# Altium schematic sheet sch.SchDoc: DataLogger Design
size 420 x 297 mm; Title2: hello; ENG_APP_DATE: --/--/--; DSN_APP_DATE: --/--/--; CHK_APP_DATE: --/--/--; Author: Minh-An DAO; DrawnBy: Minh-An DAO; Revision: 1.0; ItemRevision: 1.0; SCH_SCALE: 1:1
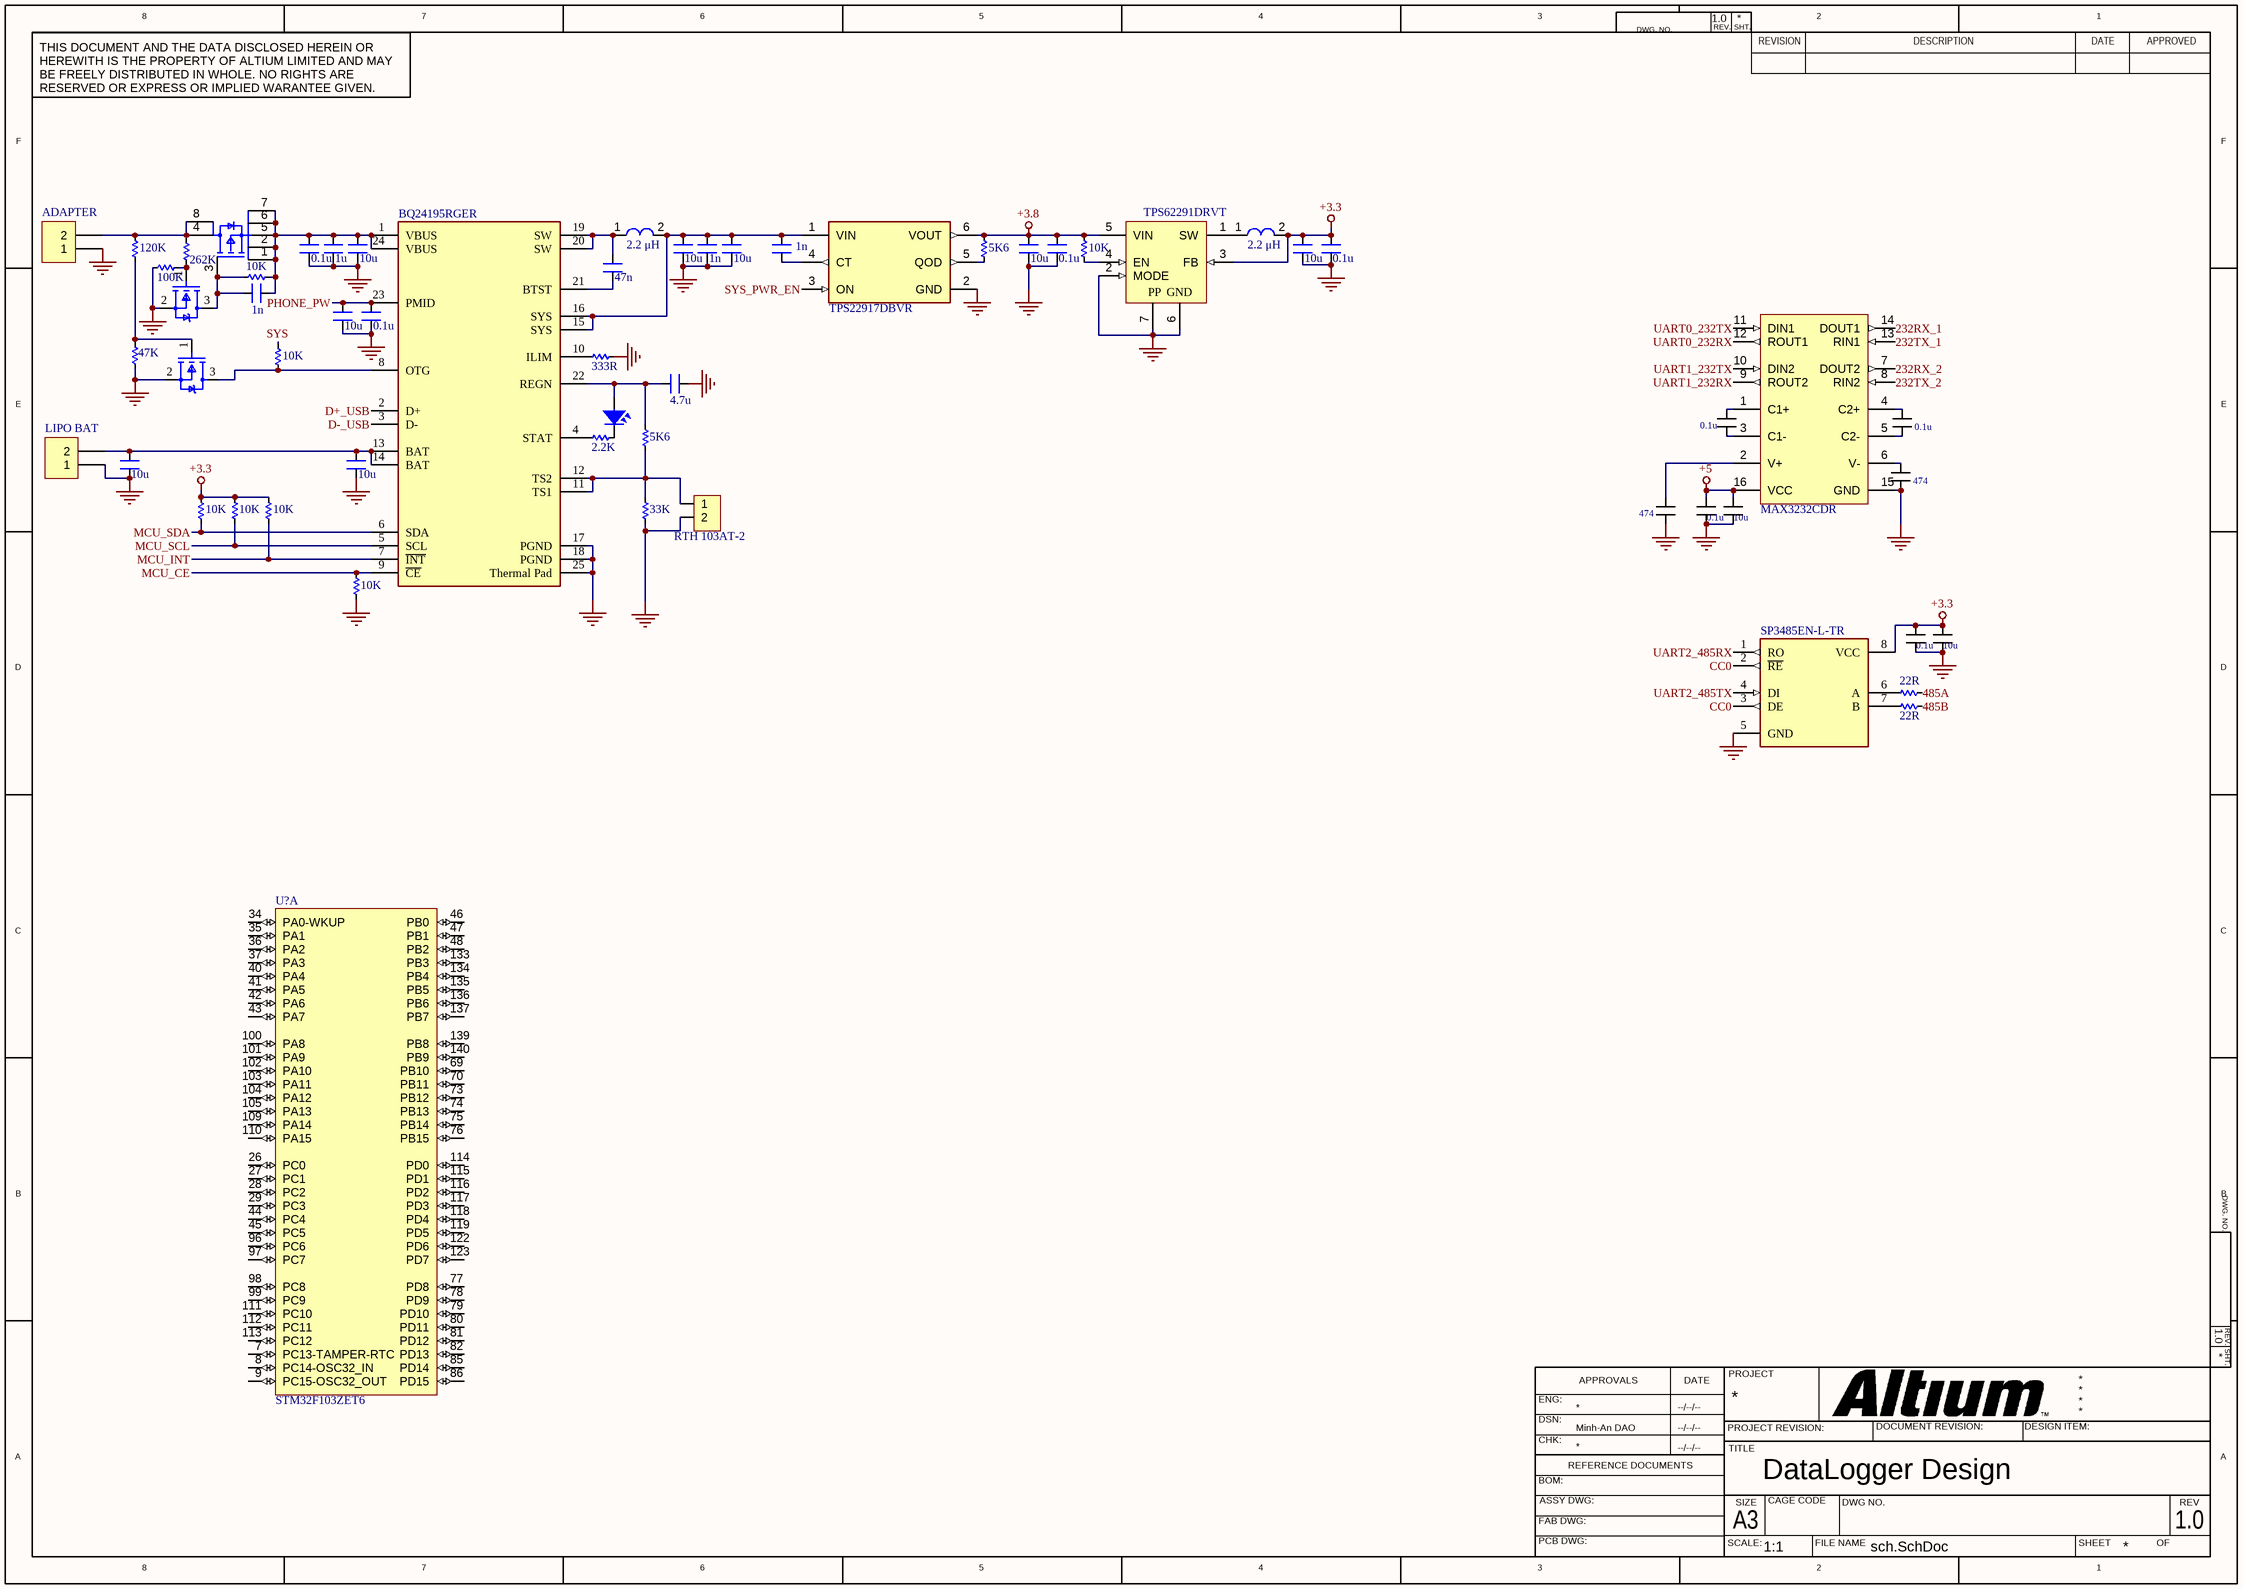
[diagram p0: sch.SchDoc]

## Parts
(Parts that share a designator on the sheet are numbered #1, #2 ... from top to bottom, then left to right.)
*  CSD25310Q2  [CSD25310Q2_DQK_0]  (value not drawn)
C?#1  0.1u  [CN-SMD-0805]
C?#2  0.1u  [CN-SMD-0805]
C?#3  474  [CN-SMD-0805]
C?#4  474  [CN-SMD-0805]
C?#5  0.1u  [CN-SMD-0805]
C?#6  10u  [CN-SMD-0805]
C?#7  RTH 103AT-2  [Header2]
C?#8  0.1u  [CN-SMD-0805]
C?#9  10u  [CN-SMD-0805]
Cx?#1  0.1u  [CN-SMD-0805]
Cx?#2  1u  [CN-SMD-0805]
Cx?#3  10u  [CN-SMD-0805]
Cx?#4  10u  [CN-SMD-0805]
Cx?#5  1n  [CN-SMD-0805]
Cx?#6  10u  [CN-SMD-0805]
Cx?#7  1n  [CN-SMD-0805]
Cx?#8  10u  [CN-SMD-0805]
Cx?#9  0.1u  [CN-SMD-0805]
Cx?#10  10u  [CN-SMD-0805]
Cx?#11  0.1u  [CN-SMD-0805]
Cx?#12  47n  [CN-SMD-0805]
Cx?#13  1n  [CN-SMD-0805]
Cx?#14  10u  [CN-SMD-0805]
Cx?#15  0.1u  [CN-SMD-0805]
Cx?#16  4.7u  [CN-SMD-0805]
Cx?#17  10u  [CN-SMD-0805]
Cx?#18  10u  [CN-SMD-0805]
J?#1  ADAPTER  [KF2-3.5]
J?#2  LIPO BAT  [KF2-3.5]
L?#1  2.2 μH  [L-SMD-M-7.3x4.5]
L?#2  2.2 μH  [L-SMD-M-7.3x4.5]
LED?  GREEN  [LED-0805-Green]  (value not drawn)
Q*  SI2312BDS-T1-E3  [SI2312BDS-T1-E3_0]  (value not drawn)
Q*?  SI2312BDS-T1-E3  [SI2312BDS-T1-E3_0]  (value not drawn)
R?#1  120K  [RES-SMD-0805]
R?#2  5K6  [RES-SMD-0805]
R?#3  10K  [RES-SMD-0805]
R?#4  262K  [RES-SMD-0805]
R?#5  100K  [RES-SMD-0805]
R?#6  10K  [RES-SMD-0805]
R?#7  47K  [RES-SMD-0805]
R?#8  10K  [RES-SMD-0805]
R?#9  333R  [RES-SMD-0805]
R?#10  2.2K  [RES-SMD-0805]
R?#11  5K6  [RES-SMD-0805]
R?#12  10K  [RES-SMD-0805]
R?#13  10K  [RES-SMD-0805]
R?#14  10K  [RES-SMD-0805]
R?#15  33K  [RES-SMD-0805]
R?#16  10K  [RES-SMD-0805]
R?#17  22R  [RES-SMD-0805]
R?#18  22R  [RES-SMD-0805]
U?#1  BQ24195RGER  [BQ24195_RGE0024H_0]
U?#2  TPS62291DRVT  [DRV0006A_V]
U?#3  TPS22917DBVR  [FP-DBV0006A-IPC_A]
U?#4  MAX3232CDR  [D0016A_L]
U?#5  SP3485EN-L-TR  [MaxLinear_NSOIC8_IPC_C]
U?#6  STM32F103ZET6  [STM-LQFP144_V]  (part A of 3)

## Nets
+3.3: C?#8.1 C?#9.1 Cx?#10.2 Cx?#11.2 L?#2.2 R?#12.1 R?#13.1 R?#14.1 U?#2.3(FB) U?#5.8(VCC)
+3.8: Cx?#8.2 Cx?#9.2 R?#2.1 R?#3.1 U?#2.5(VIN) U?#3.6(VOUT)
+5: C?#5.1 C?#6.1 U?#4.16(VCC)
GND: C?#3.2 C?#4.2 C?#5.2 C?#6.2 C?#7.2 C?#8.2 C?#9.2 Cx?#1.1 Cx?#2.1 Cx?#3.1 Cx?#4.1 Cx?#5.1 Cx?#6.1 Cx?#8.1 Cx?#9.1 Cx?#10.1 Cx?#11.1 Cx?#14.1 Cx?#15.1 Cx?#16.1 Cx?#17.1 Cx?#18.1 J?#1.1 J?#2.1 Q*.2(S) Q*?.2(S) R?#5.1 R?#7.1 R?#9.2 R?#15.2 R?#16.2 U?#1.17(PGND) U?#1.18(PGND) U?#1.25(Thermal_Pad) U?#2.2(MODE) U?#2.6(GND) U?#2.7(EP) U?#3.2(GND) U?#4.15(GND) U?#5.5(GND)
232RX_1: U?#4.14(DOUT1)
232RX_2: U?#4.7(DOUT2)
232TX_1: U?#4.13(RIN1)
232TX_2: U?#4.8(RIN2)
485A: R?#17.2
485B: R?#18.2
CC0: U?#5.2(~{RE}) U?#5.3(DE)
D+_USB: U?#1.2(D+)
D-_USB: U?#1.3(D-)
MCU_CE: R?#16.1 U?#1.9(~{CE})
MCU_INT: R?#14.2 U?#1.7(~{INT})
MCU_SCL: R?#13.2 U?#1.5(SCL)
MCU_SDA: R?#12.2 U?#1.6(SDA)
PHONE_PW: Cx?#14.2 Cx?#15.2 U?#1.23(PMID)
SYS: R?#8.1
SYS_PWR_EN: U?#3.3(ON)
UART0_232RX: U?#4.12(ROUT1)
UART0_232TX: U?#4.11(DIN1)
UART1_232RX: U?#4.9(ROUT2)
UART1_232TX: U?#4.10(DIN2)
UART2_485RX: U?#5.1(RO)
UART2_485TX: U?#5.4(DI)
Net*_1: *.1(S) *.2(S) *.5(S) *.6(S) *.7(S_PAD) Cx?#1.2 Cx?#2.2 Cx?#3.2 Cx?#13.1 R?#6.1 U?#1.1(VBUS) U?#1.24(VBUS)
Net*_3: *.3(G) Cx?#13.2 Q*.3(D) R?#6.2
Net*_4: *.4(D) *.8(D_PAD) J?#1.2 R?#1.1 R?#4.1
NetC?#1_1: C?#1.1 U?#4.1(C1+)
NetC?#1_2: C?#1.2 U?#4.3(C1-)
NetC?#2_1: C?#2.1 U?#4.4(C2+)
NetC?#2_2: C?#2.2 U?#4.5(C2-)
NetC?#3_1: C?#3.1 U?#4.6(V-)
NetC?#4_1: C?#4.1 U?#4.2(V+)
NetC?#7_1: C?#7.1 R?#11.2 R?#15.1 U?#1.11(TS1) U?#1.12(TS2)
NetCx?#4_2: Cx?#4.2 Cx?#5.2 Cx?#6.2 Cx?#7.2 L?#1.2 U?#1.15(SYS) U?#1.16(SYS) U?#3.1(VIN)
NetCx?#7_1: Cx?#7.1 U?#3.4(CT)
NetCx?#12_1: Cx?#12.1 U?#1.21(BTST)
NetCx?#12_2: Cx?#12.2 L?#1.1 U?#1.19(SW) U?#1.20(SW)
NetCx?#16_2: Cx?#16.2 LED?.1 R?#11.1 U?#1.22(REGN)
NetCx?#17_2: Cx?#17.2 Cx?#18.2 J?#2.2 U?#1.13(BAT) U?#1.14(BAT)
NetL?#2_1: L?#2.1 U?#2.1(SW)
NetLED?_2: LED?.2 R?#10.2
NetQ*?_1: Q*?.1(G) R?#1.2 R?#7.2
NetQ*?_3: Q*?.3(D) R?#8.2 U?#1.8(OTG)
NetQ*_1: Q*.1(G) R?#4.2 R?#5.2
NetR?#2_2: R?#2.2 U?#3.5(QOD)
NetR?#3_2: R?#3.2 U?#2.4(EN)
NetR?#9_1: R?#9.1 U?#1.10(ILIM)
NetR?#10_1: R?#10.1 U?#1.4(STAT)
NetR?#17_1: R?#17.1 U?#5.6(A)
NetR?#18_1: R?#18.1 U?#5.7(B)

Not connected (* = marked no-connect by the designer): U?#6 7(PC13-TAMPER-RTC) 8(PC14-OSC32_IN) 9(PC15-OSC32_OUT) 26(PC0) 27(PC1) 28(PC2) 29(PC3) 34(PA0-WKUP) 35(PA1) 36(PA2) 37(PA3) 40(PA4) 41(PA5) 42(PA6) 43(PA7) 44(PC4) 45(PC5) 46(PB0) 47(PB1) 48(PB2) 69(PB10) 70(PB11) 73(PB12) 74(PB13) 75(PB14) 76(PB15) 77(PD8) 78(PD9) 79(PD10) 80(PD11) 81(PD12) 82(PD13) 85(PD14) 86(PD15) 96(PC6) 97(PC7) 98(PC8) 99(PC9) 100(PA8) 101(PA9) 102(PA10) 103(PA11) 104(PA12) 105(PA13) 109(PA14) 110(PA15) 111(PC10) 112(PC11) 113(PC12) 114(PD0) 115(PD1) 116(PD2) 117(PD3) 118(PD4) 119(PD5) 122(PD6) 123(PD7) 133(PB3) 134(PB4) 135(PB5) 136(PB6) 137(PB7) 139(PB8) 140(PB9)

## Notes on the sheet
- 8
- 7
- 6
- 5
- 4
- 3
- DWG. NO.
- REV.
- SHT.
- REVISION
- 2
- DESCRIPTION
- DATE
- 1
- APPROVED
- THIS DOCUMENT AND THE DATA DISCLOSED HEREIN OR HEREWITH IS THE PROPERTY OF ALTIUM LIMITED AND MAY BE FREELY DISTRIBUTED IN WHOLE. NO RIGHTS ARE RESERVED OR EXPRESS OR IMPLIED WARANTEE GIVEN.
- F
- E
- D
- C
- B
- ENG:
- APPROVALS
- PROJECT
- A
- DSN:
- CHK:
- REFERENCE DOCUMENTS
- PROJECT REVISION:
- TITLE
- DOCUMENT REVISION:
- DESIGN ITEM:
- BOM:
- FAB DWG:
- PCB DWG:
- ASSY DWG:
- SCALE:
- A3
- SIZE
- CAGE CODE
- FILE NAME
- DWG NO.
- SHEET
- OF
- REV
- (in symbol CMP-0323-00380-3) PP

## Library data of the parts
* = CSD25310Q2: CSD25310Q2 20 V P-Channel NexFET™ Power MOSFETs /
C?#1-C?#6 C?#8 C?#9 = CAP
C?#7 = Header2: Header IDC, 2 x 1 Pin Vertical 2.54mm Pitch (Non-Boxed, Male); Manufacturer: W¨¹rth Elektronik eiSos GmbH; partNo: 613002143121; ComponentLink1 Description: Manufacturer; ComponentLink2 Description: Datasheet; NoPins: 02; Created Date: 29 March 2013; ComponentLink1URL: http://www.we-online.com; ComponentLink2URL: http://katalog.we-online.de/em/datasheet/6130xx143121.pdf; Created by: Karrer Zheng
Cx?#1-Cx?#18 = CN: Value: 33pF
J?#1 J?#2 = KF2: 3.9-17V; Manufacturer: Würth Elektronik eiSos GmbH; partNo: 691103110002; ComponentLink1 Description: Manufacturer; ComponentLink2 Description: Datasheet; NoPins: 2; Created Date: 29 October 2013; ComponentLink1URL: http://www.we-online.com; ComponentLink2URL: http://katalog.we-online.de/em/datasheet/6911031100xx.pdf; Created by: Karrer Zheng
L?#1 L?#2 = L-SMD-1: partNo: 78477010; Manufacturer: Wurth Elektronik; Inductance: 2.2 μH; ComponentLink1Description: Manufacturer; ComponentLink1URL: http://www.we-online.de; Created by: Baojun Chen; Created Date: Nov.2015; ComponentLink2Description: Datasheet; ComponentLink2URL: http://katalog.we-online.de/pbs/datasheet/78477010.pdf
LED? = LED SMD: Value: LED 3 - 5 ly 2 Colour
Q* Q*? = SI2312BDS-T1-E3: N-Channel 20 V (D-S) MOSFET
R?#1-R?#18 = Res-SMD: Resistor; Manufacturer: Generic Components; Class: Passive; Published: 08/06/2000; Publisher: Altium Hobart Technology Centre
U?#1 = BQ24195RGER: bq24195 I2C Controlled 2.5-A /4.5-A Single Cell USB/Adapter Charger with 5.1 V at 1 A /5.1 V at 2.1 A Synchronous Boost Operation
U?#2 = CMP-0323-00380-3: Buck Step Down Regulator with 2.3 to 6 V Input and 3.3 V Output, -40 to 85 degC, 6-Pin SON (DRV), Green (RoHS & no Sb/Br); Manufacturer: Texas Instruments; Preset Vout(V): 3.3; Switch Current Limit(Typ)(A): 1.4; Synchronous Rectification: TRUE; Duty Cycle(Max)(%): 100; Iout(Max)(A): 1; Vin(Max)(V): 6; Iq(Typ)(mA): 0.015; Rating: Catalog; SubFamily: Step-Down Regulator; Vin(Min)(V): 2.3; PartNumber: TPS62291DRVT; Mounting Technology: Surface Mount; ComponentLink2Description: Package Specification; Topology: Buck; ComponentLink1Description: Datasheet; Eco-Plan: Green (RoHS & no Sb/Br); Regulated Outputs(#): 1; ComponentLink1URL: http://www.ti.com/general/docs/lit/getliterature.tsp?genericPartNumber=TPS62291&fileType=pdf; DatasheetVersion: SLVS764C; ComponentLink3Description: URL Link1; Vout(Min)(V): 3.3; Vout(Max)(V): 3.3; PackageDescription: 6-Pin Plastic Small Outline No-Lead, 2 x 2 x 0.8 mm Body, 0.65 mm Pitch, Exposed Pad; ComponentLink2URL: http://www.ti.com/litv/pdf/mpds216d; PackageReference: DRV0006A; ComponentLink3URL: Samples URL:http://www.ti.com/product/tps62291#samples; PackageVersion: revE, Oct-2010
U?#3 = CMP-04912-000029-1: IC PWR SWITCH P-CHAN 1:1 SOT23-6; Number of Outputs: 1; Output Configuration: High Side; Fault Protection: Reverse Current; Interface: On/Off; Max Output Current: 2A; Max Operating Temperature: 125°C; Case/Package: SOT-23-6; Packaging: Tape and Reel; Number of Channels: 1; Min Operating Temperature: -40°C
U?#4 = CMP-0299-00399-2: 3-V to 5.5-V Multichannel RS-232 Line Driver / Receiver with ±15-kV ESD Protection, 0 to 70 degC, 16-Pin SOIC (D), Green (RoHS & no Sb/Br); Receivers Per Package: 2; ESD HBM(kV): +/-15; ICC(Max)(mA): 1; Supply Voltage(s)(V): 3.3 or 5.0; Single Supply: TRUE; ComponentLink1URL: www.ti.com; ComponentLink3URL: http://www.ti.com/litv/pdf/mpds178g; PackageReference: D0016A; ComponentLink2Description: Datasheet; ComponentLink2URL: http://www.ti.com/general/docs/lit/getliterature.tsp?genericPartNumber=MAX3232&fileType=pdf; ComponentLink1Description: Manufacturer URL; PackageDescription: 16-Pin Plastic Small Outline Integrated Circuit, 9.9 x 3.9 mm, Pitch 1.27 mm Pitch; PackageVersion: revM, Jun-2011; Drivers Per Package: 2; SubFamily: RS-232; DatasheetVersion: SLLS410I; ComponentLink3Description: Package Specification; RS-232: TRUE
U?#6 = CMP-0237-00176-3: ARM Cortex-M3 32-bit MCU, 512 KB Flash, 64 KB Internal RAM, 112 I/Os, 144-pin LQFP, -40 to 85 degC, Tray; D/A Converter: 2x12-bit (2 Channel); FLASH Size (Prog) (kB): 512; Internal RAM Size (kB): 64; I/Os (High Current): 112; Supply Voltage(Vcc) min (V): 2; Operating Frequency(F) (Processor speed) (MHz): 72; A/D Converter: 3x12-bit (21 Channel); ComponentLink2Description: Datasheet; PackageReference: LQFP144; ComponentLink3URL: http://www.st.com/st-web-ui/static/active/en/resource/technical/document/datasheet/DM00037051.pdf; Mounting Technology: Surface Mount; ComponentLink1URL: http://www.st.com/web/en/home.html; ComponentLink2URL: http://www.st.com/st-web-ui/static/active/en/resource/technical/document/datasheet/CD00191185.pdf; PackageVersion: Rev. 4, 06/2013; DatasheetVersion: Rev. 8; PartNumber: STM32F103ZET6; ComponentLink1Description: Manufacturer URL; PackageDescription: 144-Pin Low Profile Quad Flat Package, 20 x 20 mm Body, 0.5 mm Pitch; Core: ARM Cortex-M3; ComponentLink3Description: Package Specification; Packing: Tray